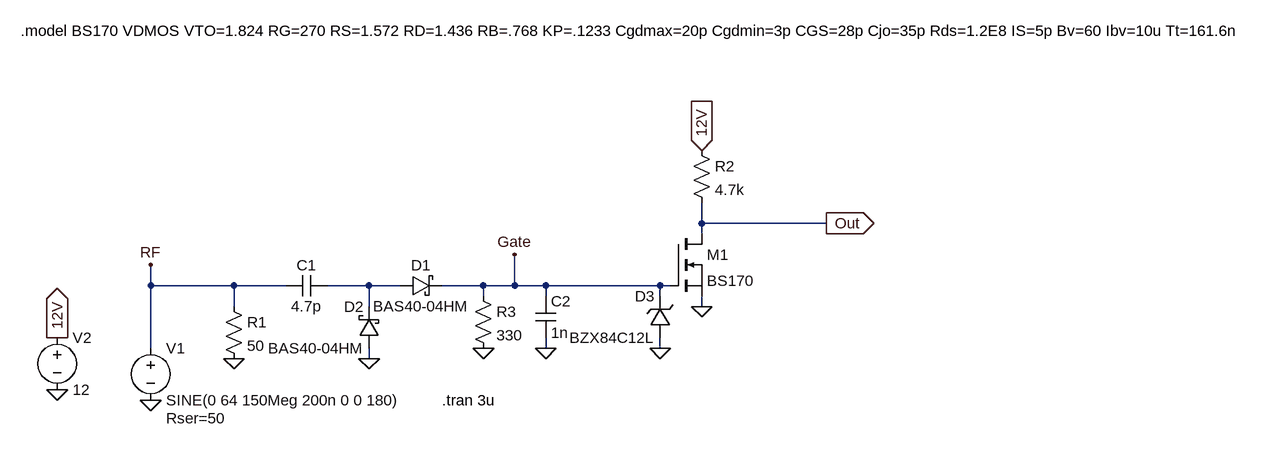
[diagram p0: schematic detector.asc]
detector.asc, the LTspice schematic file:
Version 4
SHEET 1 1456 680
WIRE -400 48 -400 16
WIRE -208 48 -400 48
WIRE -400 64 -400 48
WIRE -1248 144 -1248 112
WIRE -1120 144 -1248 144
WIRE -1040 144 -1120 144
WIRE -912 144 -976 144
WIRE -864 144 -912 144
WIRE -736 144 -800 144
WIRE -688 144 -688 96
WIRE -688 144 -736 144
WIRE -640 144 -688 144
WIRE -464 144 -640 144
WIRE -448 144 -464 144
WIRE -736 160 -736 144
WIRE -640 160 -640 144
WIRE -464 160 -464 144
WIRE -1120 176 -1120 144
WIRE -912 176 -912 144
WIRE -400 176 -400 160
WIRE -1248 240 -1248 144
WIRE -640 240 -640 224
WIRE -464 240 -464 224
WIRE -912 256 -912 240
FLAG -1248 320 0
FLAG -1120 256 0
FLAG -912 256 0
FLAG -736 240 0
FLAG -640 240 0
FLAG -1392 304 0
FLAG -1392 224 12V
IOPIN -1392 224 Out
FLAG -400 176 0
FLAG -400 -64 12V
IOPIN -400 -64 In
FLAG -208 48 Out
IOPIN -208 48 Out
FLAG -688 96 Gate
FLAG -464 240 0
FLAG -1248 112 RF
SYMBOL voltage -1248 224 R0
WINDOW 123 0 0 Left 0
WINDOW 39 24 124 Left 2
SYMATTR SpiceLine Rser=50
SYMATTR InstName V1
SYMATTR Value SINE(0 64 150Meg 200n 0 0 180)
SYMBOL res -1136 160 R0
SYMATTR InstName R1
SYMATTR Value 50
SYMBOL cap -976 128 R90
WINDOW 0 0 32 VBottom 2
WINDOW 3 32 32 VTop 2
SYMATTR InstName C1
SYMATTR Value 4.7p
SYMBOL res -752 144 R0
SYMATTR InstName R3
SYMATTR Value 330
SYMBOL cap -656 160 R0
SYMATTR InstName C2
SYMATTR Value 1n
SYMBOL voltage -1392 208 R0
WINDOW 123 0 0 Left 0
WINDOW 39 0 0 Left 0
SYMATTR InstName V2
SYMATTR Value 12
SYMBOL nmos -448 64 R0
SYMATTR InstName M1
SYMATTR Value BS170
SYMBOL res -416 -80 R0
SYMATTR InstName R2
SYMATTR Value 4.7k
SYMBOL schottky -864 160 R270
WINDOW 0 32 32 VTop 2
WINDOW 3 0 32 VBottom 2
SYMATTR InstName D1
SYMATTR Value BAS40-04HM
SYMATTR Description Diode
SYMATTR Type diode
SYMBOL schottky -896 240 R180
WINDOW 0 24 64 Left 2
WINDOW 3 24 0 Left 2
SYMATTR InstName D2
SYMATTR Value BAS40-04HM
SYMATTR Description Diode
SYMATTR Type diode
SYMBOL zener -448 224 R180
WINDOW 0 24 64 Left 2
WINDOW 3 24 0 Left 2
SYMATTR InstName D3
SYMATTR Value BZX84C12L
SYMATTR Description Diode
SYMATTR Type diode
TEXT -800 320 Left 2 !.tran 3u
TEXT -1448 -248 Left 2 !.model BS170 VDMOS VTO=1.824 RG=270 RS=1.572 RD=1.436 RB=.768 KP=.1233 Cgdmax=20p Cgdmin=3p CGS=28p Cjo=35p Rds=1.2E8 IS=5p Bv=60 Ibv=10u Tt=161.6n

The netlist it stands for:
* detector.asc
V1 RF 0 SINE(0 64 150Meg 200n 0 0 180) Rser=50
R1 RF 0 50
C1 N001 RF 4.7p
R3 Gate 0 330
C2 Gate 0 1n
V2 12V 0 12
M1 Out Gate 0 0 BS170
R2 12V Out 4.7k
D1 N001 Gate BAS40-04HM
D2 0 N001 BAS40-04HM
D3 0 Gate BZX84C12L
.model D D
.lib standard.dio
.model NMOS NMOS
.model PMOS PMOS
.lib standard.mos
.tran 3u
.model BS170 VDMOS VTO=1.824 RG=270 RS=1.572 RD=1.436 RB=.768 KP=.1233 Cgdmax=20p Cgdmin=3p CGS=28p Cjo=35p Rds=1.2E8 IS=5p Bv=60 Ibv=10u Tt=161.6n
.backanno
.end

* Results of the author's LTspice run, read from the files saved beside the schematic
* Operating Point, zero values left out:
*   V(12v) = 12 V
*   V(out) = 12 V
*   Id(M1) = 100 nA
*   Is(M1) = -100 nA
*   I(R2) = 100 nA
*   I(V2) = -100 nA
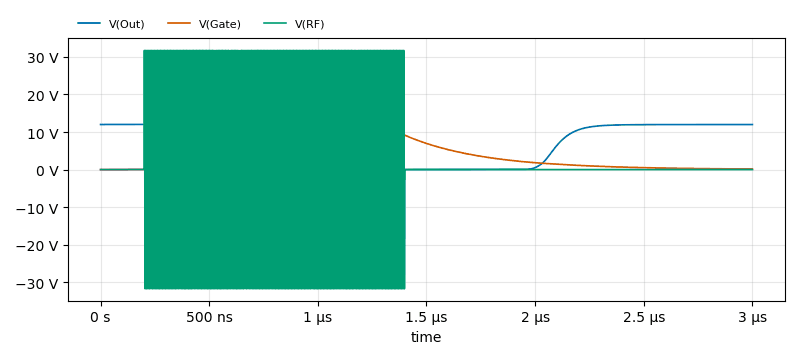
[diagram p1: Transient Analysis of detector.asc, plotted from the saved traces]
* Transient Analysis, 1 run:
*   V(Out): min 8.531 mV, max 12.32 V, average 4.741 V, rms 7.379 V, last 11.99 V
*   V(Gate): min 0 V, max 9.257 V, average 4.053 V, rms 5.36 V, last 140.6 mV
*   V(RF): min -31.74 V, max 31.74 V, average 1.068 mV, rms 14.07 V, last -50.99 µV